# Altium schematic sheet Power.SchDoc
size A4; SheetNumber: 1; SheetTotal: 1
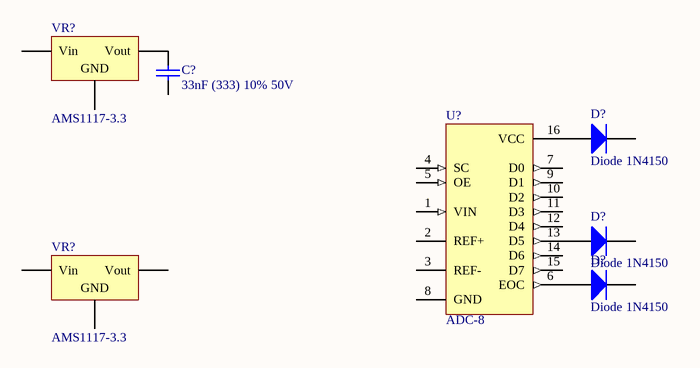
[diagram p0: Power.SchDoc]

## Parts
(Parts that share a designator on the sheet are numbered #1, #2 ... from top to bottom, then left to right.)
C?  33nF (333) 10% 50V  [0603_C]
D?#1  Diode 1N4150  [DO-35]
D?#2  Diode 1N4150  [DO-35]
D?#3  Diode 1N4150  [DO-35]
U?  ADC-8  [SOT403-1_N]
VR?#1  AMS1117-3.3  [SOT-223]
VR?#2  AMS1117-3.3  [SOT-223]

## Nets
NetC?_2: C?.2 VR?#1.2(Vout)
NetD?#1_1: D?#1.1(A) U?.16(VCC)
NetD?#2_1: D?#2.1(A) U?.13(D5)
NetD?#3_1: D?#3.1(A) U?.6(EOC)

Not connected (* = marked no-connect by the designer): C? 1; D?#1 2(K); D?#2 2(K); D?#3 2(K); U? 1(VIN) 2(REF+) 3(REF-) 4(SC) 5(OE) 7(D0) 8(GND) 9(D1) 10(D2) 11(D3) 12(D4) 14(D6) 15(D7); VR?#1 1(GND) 3(Vin); VR?#2 1(GND) 2(Vout) 3(Vin)

## Library data of the parts
C? = 0603 33nF (333) 10% 50V: 贴片电容; ComponentLink1Description: 供应商链接; ComponentLink1URL: http://www.szlcsc.com/product/details_21829.html; Package: 0603; Supplier: LC; SuppliersPartNumber: C21117
D?#1-D?#3 = Diode 1N4150: High Conductance Ultra Fast Diode; Published: 8-Jun-2000; LatestRevisionDate: 17-Jul-2002; LatestRevisionNote: Re-released for DXP Platform.; DatasheetVersion: 1997; PackageReference: DO-35; Publisher: Altium Limited; PackageDescription: Diode, Axial; Body 3.8 x 1.9 mm (LxDia. max), Lead Dia. 0.53 mm (max); Code_JEDEC: DO-204-AH; ComponentLink1Description: Manufacturer Link; ComponentLink1URL: http://www.fairchildsemi.com/
U? = ADC-8: Generic 8-Bit A/D Converter; Published: 8-Jun-2000; LatestRevisionDate: 29-May-2009; LatestRevisionNote: IPC-7351 Footprint Added.; PackageVersion: Mar-2002; PackageReference: SOT403-1; Publisher: Altium Limited; PackageDescription: 16-Pin Thin Small Outline Package 0.65 mm Pitch; Code_JEDEC: MO-153
VR?#1 VR?#2 = SOT-223 AMS1117-3.3: 低压差线性稳压(LDO); ComponentLink1Description: 供应商链接; ComponentLink1URL: http://www.szlcsc.com/product/details_6652.html; Package: SOT-223; Supplier: LC; SuppliersPartNumber: C6186